# Altium schematic sheet POWER.SchDoc
size A
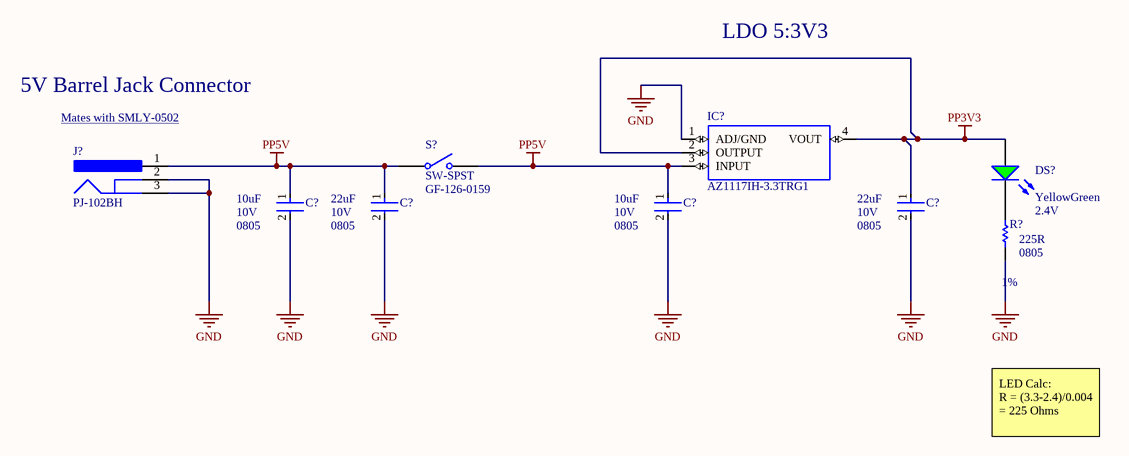
[diagram p0: POWER.SchDoc]

## Parts
(Parts that share a designator on the sheet are numbered #1, #2 ... from top to bottom, then left to right.)
C?#1  Case/Package: 0805  Voltage Rating (DC): 10V  Capacitance: 10uF  [FP-GRM21B-0_15-IPC_A]  (hidden comment: GRM21BR71A106KA73K)
C?#2  Capacitance: 22uF  Voltage Rating: 10V  Case/Package: 0805  [FP-GRM21B-0_15-MFG]  (hidden comment: GRM21BR61A226ME51L)
C?#3  Case/Package: 0805  Voltage Rating (DC): 10V  Capacitance: 10uF  [FP-GRM21B-0_15-IPC_A]  (hidden comment: GRM21BR71A106KA73K)
C?#4  Capacitance: 22uF  Voltage Rating: 10V  Case/Package: 0805  [FP-GRM21B-0_15-MFG]  (hidden comment: GRM21BR61A226ME51L)
DS?  Emitting Color: YellowGreen  Forward Voltage: 2.4V  [DIAL-0805-2_V]  (hidden comment: 598-8170-107F)
IC?  AZ1117IH-3.3TRG1  [SOT230P700X170-4N]
J?  PJ-102BH  [CUI-PJ-102BH_V]
R?  Resistance: 225R  Package Reference: 0805  Tolerance: 1%  [RESC2013X70X40NL20T20]  (hidden comment: ERJ6ENF2200V)
S?  SW-SPST  Manufacturer Part Number: GF-126-0159

## Nets
GND: C?#1.2 C?#2.2 C?#3.2 C?#4.2 IC?.1(ADJ/GND) J?.2 J?.3 R?.1
PP3V3: C?#4.1 DS?.1(A) IC?.2(OUTPUT) IC?.4(VOUT)
PP5V: C?#1.1 C?#2.1 C?#3.1 IC?.3(INPUT) J?.1 S?.1(COMMON) S?.2(NO)
NetDS?_2: DS?.2(K) R?.2

## Notes on the sheet
- LDO 5:3V3
- 5V Barrel Jack Connector
- (near J?) Mates with SMLY-0502 <https://www.amazon.ca/100-240V-5-52-5mm-Transformer-Electronic-Equipment/dp/B086JRWFD9/ref=sr_1_5?keywords=5v%2Bdc%2Bpower%2Bsupply&qid=1638245414&refinements=p_85%3A5690392011&rnid=5690384011&rps=1&sr=8-5&th=1>
- LED Calc:
  R = (3.3-2.4)/0.004 = 225 Ohms

## Library data of the parts
C?#1 C?#3 = CMP-06035-038134-1: Chip Multilayer Ceramic Capacitors for General Purpose, 0805, 10uF, X7R, 15%, 10%, 10V; Manufacturer: Murata Electronics; Dielectric: X7R; Thickness: 1.25mm; Tolerance: 10%; Length: 2mm; Width: 1.25mm; Manufacturer Part Number: GRM21BR71A106KA73K; Supplier Part Number: 490-14381-1-ND; Supplier: Digi-Key
C?#2 C?#4 = CMP-2000-06340-2: Chip Multilayer Ceramic Capacitors for General Purpose, 0805, 22uF, X5R, 15%, 20%, 10V; Manufacturer: Murata Electronics; Thickness: 0.055inch; Length: 2mm; Tolerance: 20%; Max Operating Temperature: 85°C; REACH SVHC: No SVHC; Radiation Hardening: No; Weight: 0.000335oz; Case Code (Metric): 2012; Case Code (Imperial): 0805; Height: 1.25mm; Min Operating Temperature: -55°C; Voltage Rating (DC): 10V; Lead Free: Lead Free; Package Quantity: 3000; Dielectric: X5R; Mount: Surface Mount; Termination: SMD/SMT; Width: 0.049inch; Depth: 1.25mm; Packaging: Tape and Reel; Manufacturer Part Number: GRM21BR61A226ME51L; Supplier Part Number: 490-10511-1-ND; Supplier: Digi-Key
DS? = CMP-2000-05655-1: Single Color, 2 V, -30 to 85 degC, 2-Pin SMD (0805), RoHS, Tape and Reel; Manufacturer: Dialight; Manufacturer Part Number: 5988170107F; Main Category: ChipLED; Shape Type: Rectangular; Forward Current: 25mA; Product Length (mm): 2mm; Test Current (It): 20mA; Number of  Elements: 1; Luminous Intensity: 20mcd; DELETED: Compliant; Reverse Voltage: 5V; Chip Material: GaP; High Brightness: No; Viewing Angle: 140deg; Dominant Wave Length: 570nm; Type: Uni-Color; Product Depth (mm): 1.25mm; Power Dissipation: 60W; Product Height (mm): 0.7mm; Lens Dimensions: 1.4x1.25x0.4mm; Pin Count: 2; Datasheet URL: https://datasheet.ciiva.com/22748/1484480-22748121.pdf; Operating Temperature Classification: Commercial; Package Reference: 0805; Operating Temp Range: -30Cto85C; Mounting: SurfaceMount; Mounting Technology: SurfaceMount; Manufacturer URL: http://www.dialight.com/; Package Description: 2-Pin Surface Mount Device, Body 2 x 1.25 mm; Lum Intensity: 20mcd; Datasheet Version: 10/2008; Rad Hardened: No; Packaging: TapeandReel; Package Type: SMD; Supplier: Digi-Key; Supplier Part Number: 350-2044-1-ND
IC? = AZ1117IH-3.3TRG1: Linear Voltage Regulator IC Positive Fixed 1 Output 1A SOT-223; Manufacturer: Diodes Incorporated; MF: Diodes Inc.; Price: None; Purchase-URL: https://pricing.snapeda.com/search/part/AZ1117IH-3.3TRG1/?ref=eda; Check_prices: https://www.snapeda.com/parts/AZ1117IH-3.3TRG1/Diodes%20Inc./view-part/490259/?ref=eda; Value: *; MP: AZ1117IH-3.3TRG1; Availability: Warning; SnapEDA_Link: https://www.snapeda.com/parts/AZ1117IH-3.3TRG1/Diodes%20Inc./view-part/490259/?ref=snap; Package: SOT-223 Diodes Inc.; Manufacturer Part Number: AZ1117IH-3.3TRG1; Supplier: Digi-Key; Supplier Part Number: AZ1117IH-3.3TRG1DICT-ND
J? = CMP-2000-06901-1: Through Hole Right Angle DC Power Jack, 5 A, 2.5 mm Center Pin, 3 Position, -25 to 85 degC, RoHS, Bulk; Manufacturer: CUI Devices; Outside Contact Diameter: 6.5mm; Current Rating: 5A; Brand: CUI; Insulation Resistance: 100MOhms; Inside Contact Diameter: 2.5mm; Voltage Rating: 24V; Operating Temperature Range: -25Cto+85C; Mounting Angle: Right; Mounting Technology: ThroughHole; Product Category: DCPowerConnectors; Datasheet Version: Rev. 1.02, 05/2016; Connector Type: DCPowerJack; Contact Material: Copper; Housing Material: PolybutyleneTerephthalate(PBT); Mounting Style: ThroughHole; Product: Jacks; Package Reference: PJ-102BH; Manufacturer URL: http://www.cui.com/; RoHS: True; Contact Gender: Male; Contact Plating: Nickel; Flammability Rating: UL94V-0; Factory Pack Quantity: 280; Datasheet URL: http://www.cui.com/product/resource/pj-102bh.pdf; Package Description: 3-Pin Through Hole Device, Body 14.4 x 9 mm, Height 11 mm; Termination Style: ThroughHole; Manufacturer Part Number: PJ-102BH; Supplier: Digi-Key; Supplier Part Number: CP-102BH-ND
R? = CMP-2001-00044-1: Manufacturer: Panasonic; Manufacturer Part Number: ERJ6ENF2200V; Supplier: P220CCT-ND; Supplier Part Number: Digi-Key
S? = SW-SPST: Single-Pole, Single-Throw Switch; Manufacturer: CW Industries; Published: 24-Mar-1999; LatestRevisionDate: 17-Jul-2002; LatestRevisionNote: Re-released for DXP Platform.; PackageReference: SPST-2; Publisher: Altium Limited; PackageDescription: Switch; 2 Leads; Supplier Part Number: SW342-ND; Supplier: Digi-Key